# EAGLE design ross_comp (EAGLE 7.6.0)
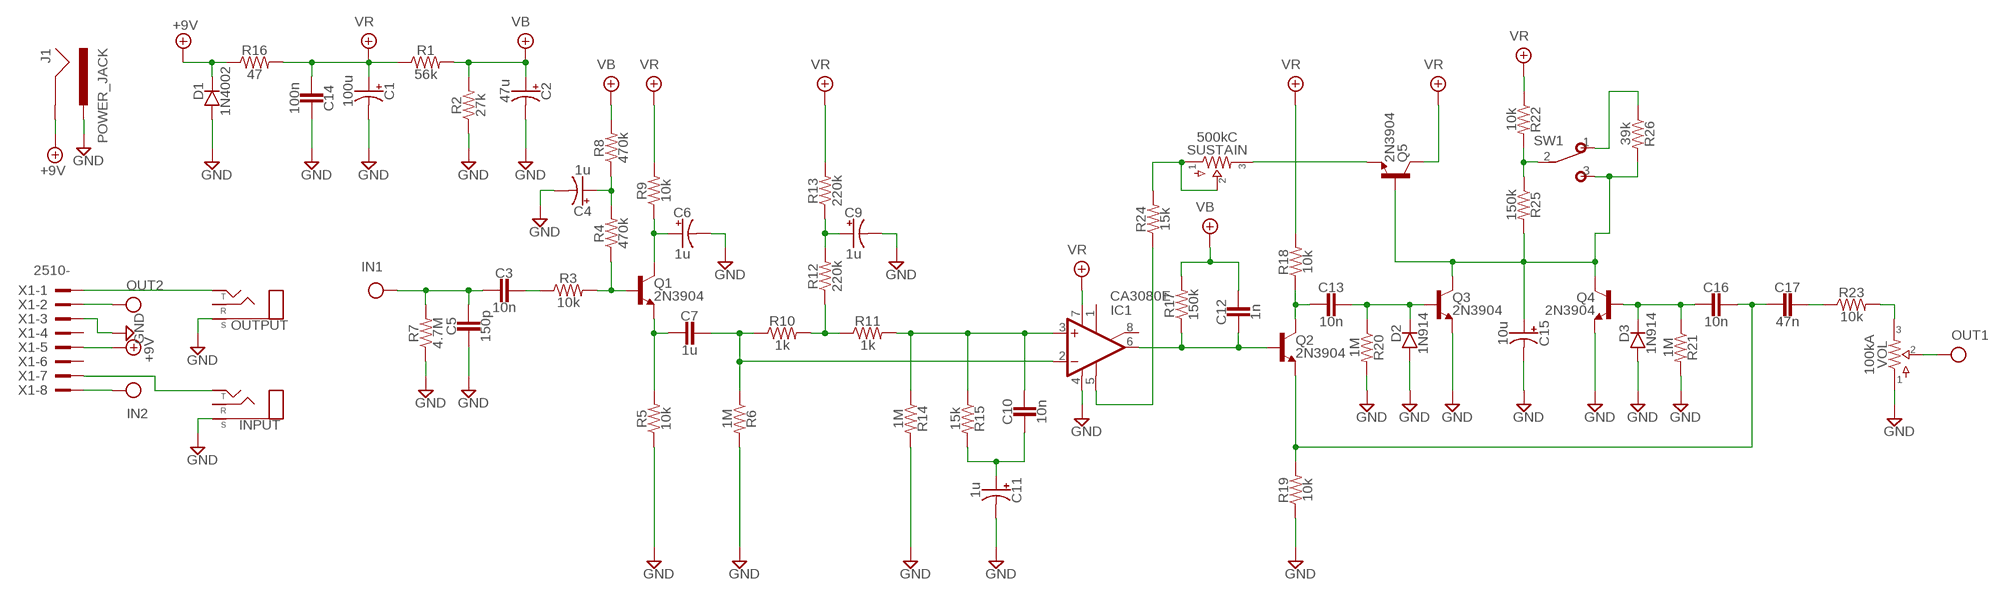
[diagram p0: schematic, sheet 1]

## Parts
C1  100u  0400  [040_020]
C2  47u  0400  [040_020]
C3  10n  CER/FILMBOX.1  [BOX_SMALL]
C4  1u  0400  [040_020]
C5  150p  CER/FILM2  [050X030_025_2]
C6  1u  0400  [040_020]
C7  1u  CER/FILMBOX.3  [BOX_BIG]
C9  1u  0400  [040_020]
C10  10n  CER/FILMBOX.1  [BOX_SMALL]
C11  1u  0400  [040_020]
C12  1n  CER/FILMBOX.1  [BOX_SMALL]
C13  10n  CER/FILMBOX.1  [BOX_SMALL]
C14  100n  CER/FILMBOX.1  [BOX_SMALL]
C15  10u  0400  [040_020]
C16  10n  CER/FILMBOX.1  [BOX_SMALL]
C17  47n  CER/FILMBOX.1  [BOX_SMALL]
D1  1N4002  DO41.2  [DO41-2]
D2  1N914  DO35.2  [DO35-2]
D3  1N914  DO35.2  [DO35-2]
IC1  CA3080E  3080TH  [DIL08]
INPUT  STEREONMJ  [NMJ6HCD2]
J1  POWER_JACK  [POWER_JACK_PTH]
OUTPUT  STEREONMJ  [NMJ6HCD2]
Q1  2N3904  [TO92-]
Q2  2N3904  [TO92-]
Q3  2N3904  [TO92-]
Q4  2N3904  [TO92-]
Q5  2N3904  [TO92-]
R1  56k  R_.3B  [R0207/3]
R2  27k  R_.3B  [R0207/3]
R3  10k  R_.3B  [R0207/3]
R4  470k  R_.3B  [R0207/3]
R5  10k  R_.3B  [R0207/3]
R6  1M  R_.3B  [R0207/3]
R7  4.7M  R_.3B  [R0207/3]
R8  470k  R_.3B  [R0207/3]
R9  10k  R_.3B  [R0207/3]
R10  1k  R_.3B  [R0207/3]
R11  1k  R_.3B  [R0207/3]
R12  220k  R_.3B  [R0207/3]
R13  220k  R_.3B  [R0207/3]
R14  1M  R_.3B  [R0207/3]
R15  15k  R_.3B  [R0207/3]
R16  47  R_.3B  [R0207/3]
R17  150k  R_.3B  [R0207/3]
R18  10k  R_.3B  [R0207/3]
R19  10k  R_.3B  [R0207/3]
R20  1M  R_.3B  [R0207/3]
R21  1M  R_.3B  [R0207/3]
R22  10k  R_.3B  [R0207/3]
R23  10k  R_.3B  [R0207/3]
R24  15k  R_.3B  [R0207/3]
R25  150k  R_.3B  [R0207/3]
R26  39k  R_.3B  [R0207/3]
SUSTAIN  500kC  POTS16MM  [16MM]
SW1  SPDT  [M9040P]
VOL  100kA  POTS16MM  [16MM]
X1  2510-  [PAK100/2500-10]

## Nets
+9V: D1.C J1.GND R16.1 X1.5
GND: C1.- C2.- C4.- C5.2 C6.- C9.- C11.- C14.1 C15.- D1.A D2.A D3.A IC1.4(V-) INPUT.S J1.PWR OUTPUT.S Q3.3(E) Q4.3(E) R2.1 R5.1 R6.2 R7.1 R14.2 R19.1 R20.2 R21.2 VOL.1 X1.3
IN: C3.2 C5.1 R7.2 X1.8
N$1: INPUT.T X1.7
N$2: C3.1 R3.1
N$3: Q1.2(B) R3.2 R4.1
N$4: OUTPUT.T X1.1
N$5: C4.+ R4.2 R8.1
N$6: R26.1 SW1.1(O)
N$7: C6.+ Q1.1(C) R9.1
N$8: C7.1 IC1.2(-IN) R6.1 R10.1
N$9: C7.2 Q1.3(E) R5.2
N$10: C10.1 IC1.3(+IN) R11.2 R14.1 R15.1
N$11: R10.2 R11.1 R12.1
N$12: C9.+ R12.2 R13.1
N$13: C10.2 C11.+ R15.2
N$14: C13.2 Q2.1(C) R18.1
N$15: C12.2 IC1.6(OUT) Q2.2(B) R17.1
N$16: C16.1 C17.2 Q2.3(E) R19.2
N$17: C13.1 D2.C Q3.2(B) R20.1
N$18: C15.+ Q3.1(C) Q4.1(C) Q5.2(B) R25.2 R26.2 SW1.3(S)
N$19: C16.2 D3.C Q4.2(B) R21.1
N$20: R22.2 R25.1 SW1.2(P)
N$21: C17.1 R23.1
N$22: R23.2 VOL.3
N$23: Q5.3(E) SUSTAIN.3
N$25: R24.2 SUSTAIN.1 SUSTAIN.2
N$26: IC1.5(OPT) R24.1
OUT: VOL.2 X1.2
VB: C2.+ C12.1 R1.2 R2.2 R8.2 R17.2
VR: C1.+ C14.2 IC1.7(V+) Q5.1(C) R1.1 R9.2 R13.2 R16.2 R18.2 R22.1
Unconnected: IC1.1(ON1) IC1.8(ON2) INPUT.R OUTPUT.R X1.4 X1.6

## Library data of the parts
C1 C2 C4 C6 C9 C11 C15 = pedals-capacitors-elec:040
C3 C5 C7 C10 C12-C14 C16 C17 = pedals-capacitors-film:CER/FILM: 47 - 120pF Xicon Ceramic Disc 2.5mm lead spacing
D1 = pedals-diodes:DO41: DO-41 Package Diodes: 1N4001 - 1N40019 Zener Diodes: 1N4728 - 1N4764
D2 D3 = pedals-diodes:DO35: DO-35 Package Diodes: 1N914
IC1 = pedals-integrated circuits:3080: OP AMP
INPUT OUTPUT = pedals-jacks:STEREO
J1 = pedals-jacks:POWER_JACK: Power Jack Connector This is the standard 5.5mm barrel jack for power. The PTH is the most common, proven, reliable, footprint. The Slot footprint only works if the mill layer is transmitted to the PCB fab house so be warned. Here are the connectors we sell at SparkFun: DC Barrel Power Jack/Connector <https://www.sparkfun.com/products/119> (PRT-00119) DC Barrel Power Jack/Connector (SMD) <https://www.sparkfun.com/products/12748> (PRT-12748) DC Barrel Jack Adapter - Breadboard Compatible <https://www.sparkfun.com/products/10811> (PRT-10811) It is used on this SparkFun product (and many, many others): SparkFun RedBoard - Programmed with Arduino <https://www.sparkfun.com/products/12757> (DEV-12757) Also, if you need a mating power supply or connector, please check these out: Wall Adapter Power Supply - 9VDC 650mA <https://www.sparkfun.com/products/298> (TOL-00298) DC Barrel Jack Adapter - Male <https://www.sparkfun.com/products/10287> (PRT-10287); PROD_ID: CONN-08197
Q1-Q5 = pedals-transistors:2N3904: NPN Transistor
R1-R26 = pedals-resistors:R_
SUSTAIN VOL = pedals-potentiometers:POTS
SW1 = pedals-switches:SPDT: TOGGLE SWITCH Marquardt
X1 = pedals-headers:2510-: 3M (TM) Pak 100 4-Wall Header Source: 3M; MF: 3M; MPN: 2510-6002UB; OC_FARNELL: 9838244; OC_NEWARK: 46F4725

## Board
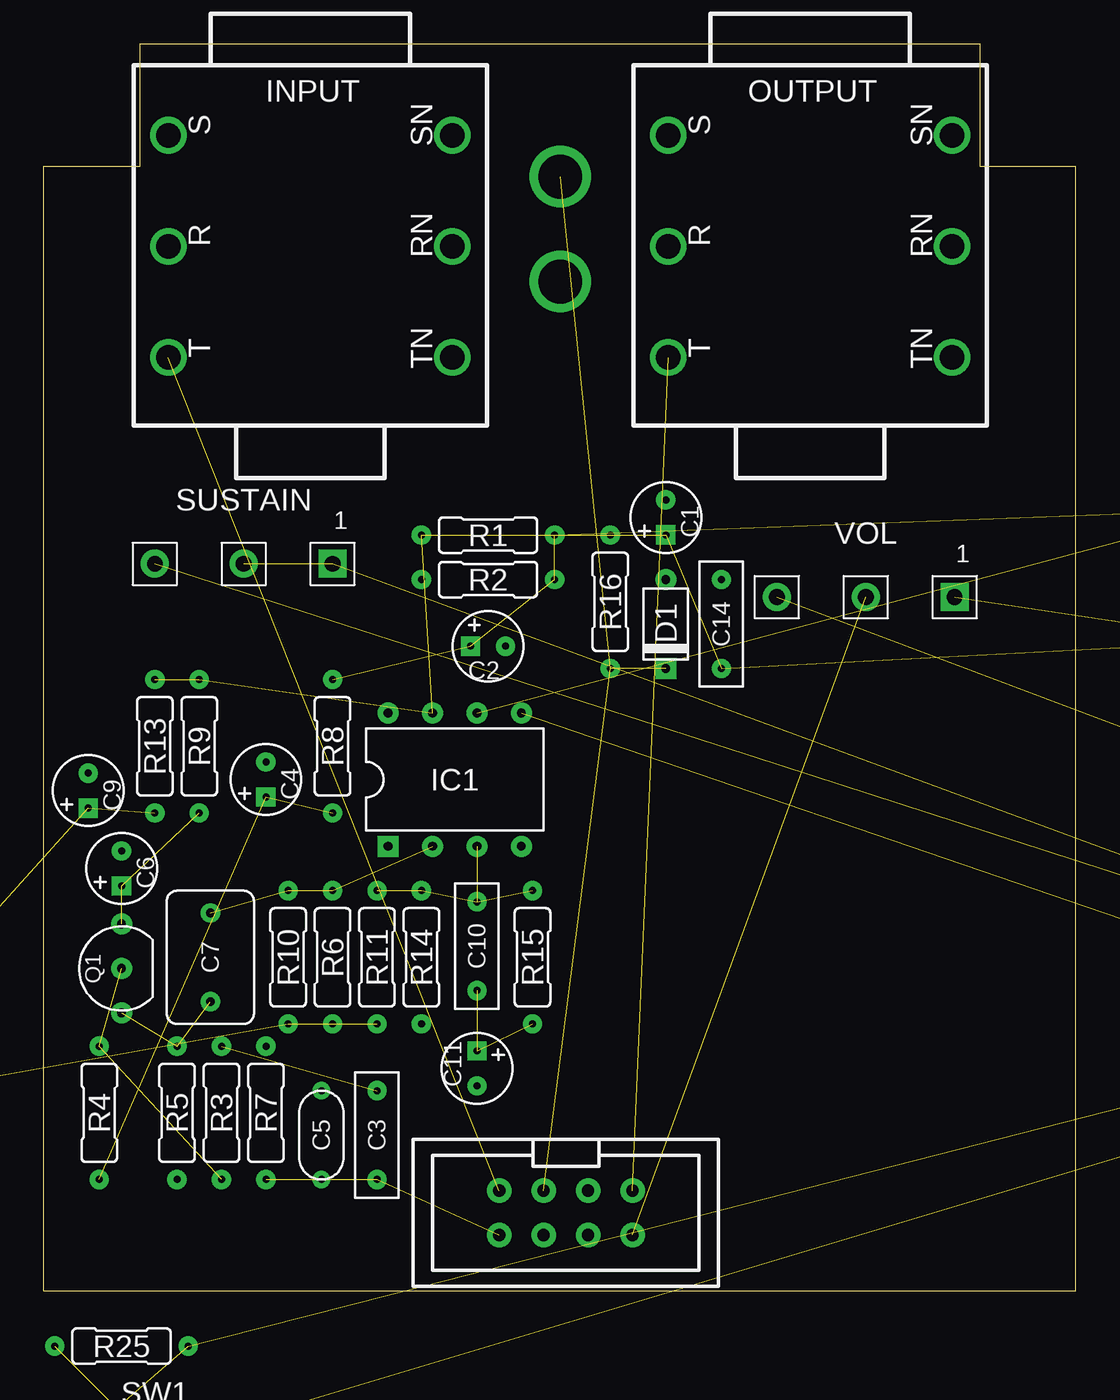
[diagram p1: board, top side]
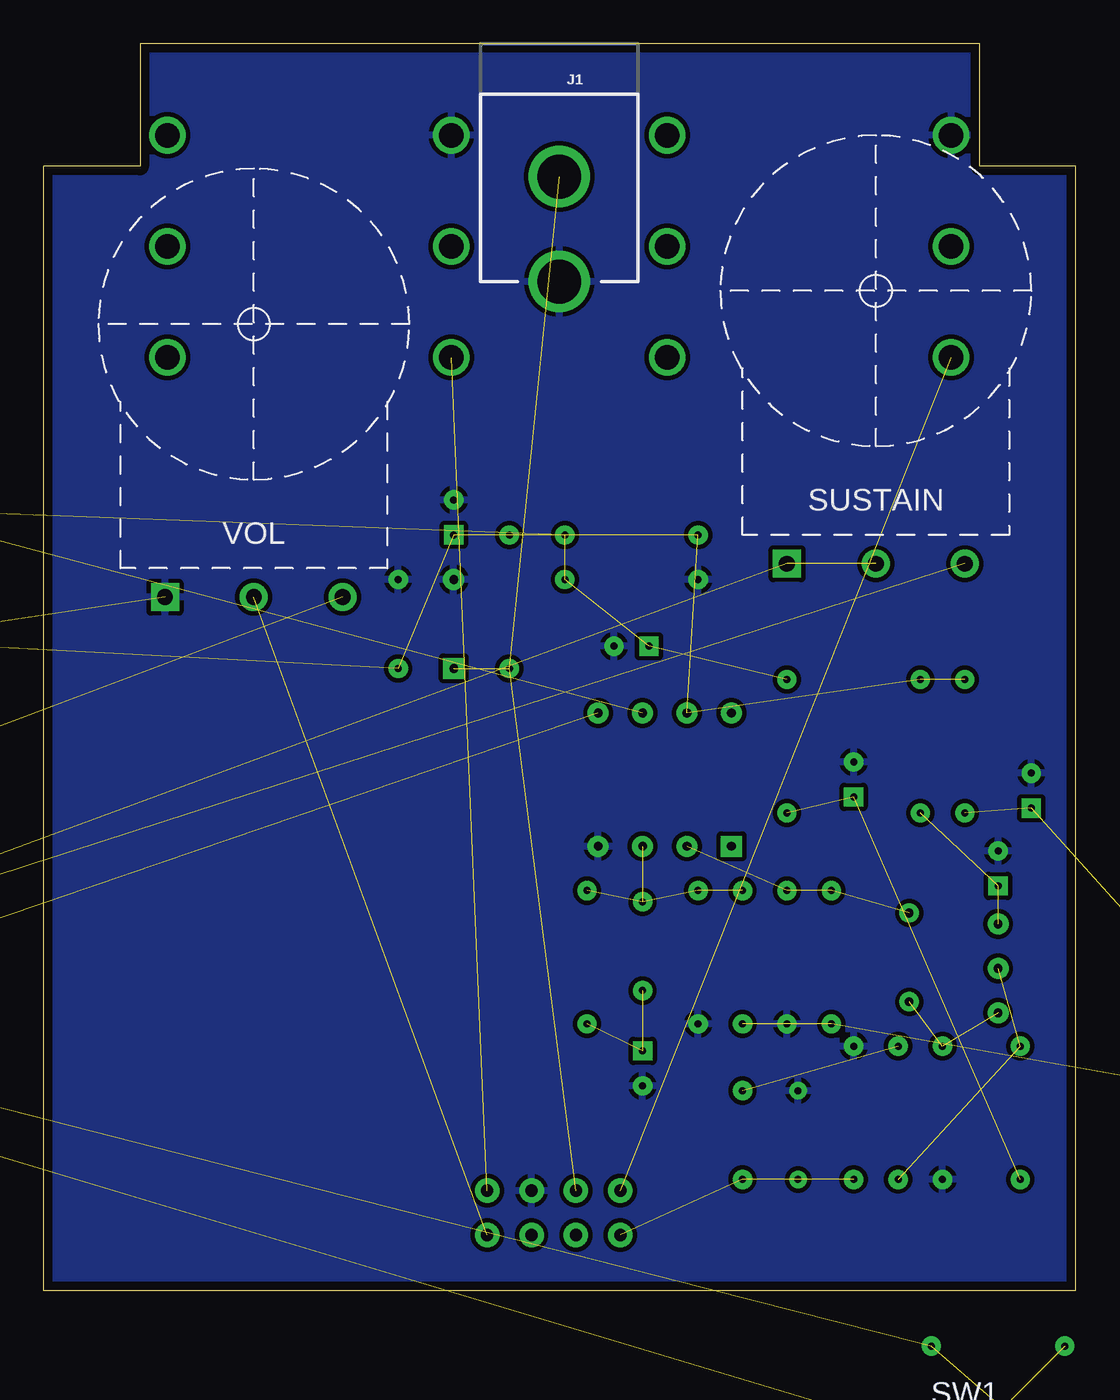
[diagram p2: board, bottom side, seen from below]

Size 59 x 71.27 mm. Coordinates in mm from the lower left corner, seen from the top.
Copper layers (1*16): Top 0.035mm / dielectric 1.6mm / Bottom 0.035mm
Design rules "Elecrow_2-layer_PCB_eagle_rule": minimum track width 6mil, minimum drill 12mil, track to track 6mil, track to pad 6mil, pad to pad 6mil, via to via 8mil, smd to smd 0mil, copper to edge 20mil, drill to drill 10mil, minimum pad ring 6mil, minimum via ring 6mil, stop-mask expansion 0mil, vias tented up to drill 100mil, thermal gap 10mil

### Footprints (pad centres in the part's own frame; a part is rotated, then mirrored left to right if it is on the bottom)
040_020 = drill 0.4 pad 1.1 square: + -1.001,0 | drill 0.4 pad 1.1: - 1.001,0
BOX_SMALL = drill 0.4 pad 1.1: 1 -2.54,0; 2 2.54,0
050X030_025_2 = drill 0.4 pad 1: 1 -2.54,0; 2 2.54,0
BOX_BIG = drill 0.5 pad 1.1: 1 -2.54,0; 2 2.54,0
DO41-2 = drill 0.5 pad 1.2: A 2.54,0 | drill 0.5 pad 1.2 square: C -2.54,0
DO35-2 = drill 0.5 pad 1.2: A 2.54,0 | drill 0.5 pad 1.2 square: C -2.54,0
DIL08 = drill 0.5 pad 1.2 square: 1 -3.81,-3.81 | drill 0.5 pad 1.2: 2 -1.27,-3.81; 3 1.27,-3.81; 4 3.81,-3.81; 5 3.81,3.81; 6 1.27,3.81; 7 -1.27,3.81; 8 -3.81,3.81
NMJ6HCD2 = drill 1.4: R 0,8.115; RN 0,-8.115; S 6.35,8.115; SN 6.35,-8.115; T -6.35,8.115; TN -6.35,-8.115
POWER_JACK_PTH = drill 2.5: GND 0,7.7; PWR 0,13.7
TO92- = drill 0.5 pad 1.2: 1 2.54,0; 2 0,0; 3 -2.54,0
R0207/3 = drill 0.4 pad 1.1: 1 -3.81,0; 2 3.81,0
16MM = drill 0.9 pad 1.6 square: 1 5.08,-1 | drill 0.9 pad 1.6: 2 0,-1; 3 -5.08,-1
M9040P = drill 2.4 square: 1 4.699,0 | drill 2.4: 2 0,0; 3 -4.699,0
PAK100/2500-10 = drill 0.7 pad 1.4: 1 -3.81,-1.27; 2 -3.81,1.27; 3 -1.27,-1.27; 4 -1.27,1.27; 5 1.27,-1.27; 6 1.27,1.27; 7 3.81,-1.27; 8 3.81,1.27

### Placement (x,y rotation side)
C1  35.56,44.2 90 top
C2  25.4,36.83 0 top
C3  19.05,8.89 270 top
C4  12.7,29.21 90 top
C5  15.88,8.89 90 top
C6  4.45,24.13 90 top
C7  9.53,19.05 270 top
C9  2.54,28.57 90 top
C10  24.77,19.68 270 top
C11  24.77,12.7 270 top
C12  81.92,45.09 0 top  (outside the outline)
C13  81.92,33.02 0 top  (outside the outline)
C14  38.73,38.1 270 top
C15  81.28,15.24 0 top  (outside the outline)
C16  81.92,6.35 0 top  (outside the outline)
C17  96.52,22.23 0 top  (outside the outline)
D1  35.56,38.1 90 top
D2  81.92,27.94 0 top  (outside the outline)
D3  81.92,11.43 0 top  (outside the outline)
IC1  23.5,29.21 0 top
INPUT  15.24,59.69 90 top
J1  29.53,71.37 180 bottom
OUTPUT  43.81,59.69 90 top
Q1  4.45,18.41 90 top
Q2  81.92,41.27 0 top  (outside the outline)
Q3  81.92,24.13 0 top  (outside the outline)
Q4  81.92,19.68 0 top  (outside the outline)
Q5  96.52,13.34 0 top  (outside the outline)
R1  25.4,43.18 0 top
R2  25.4,40.64 0 top
R3  10.16,10.16 270 top
R4  3.17,10.16 270 top
R5  7.62,10.16 90 top
R6  16.51,19.05 270 top
R7  12.7,10.16 270 top
R8  16.51,31.11 90 top
R9  8.89,31.11 90 top
R10  13.97,19.05 270 top
R11  19.05,19.05 90 top
R12  -7.62,12.06 180 top  (outside the outline)
R13  6.35,31.11 90 top
R14  21.59,19.05 270 top
R15  27.94,19.05 270 top
R16  32.38,39.37 90 top
R17  83.19,47.62 0 top  (outside the outline)
R18  83.19,38.1 0 top  (outside the outline)
R19  83.19,35.56 0 top  (outside the outline)
R20  83.19,30.48 0 top  (outside the outline)
R21  83.19,8.89 0 top  (outside the outline)
R22  97.79,19.68 0 top  (outside the outline)
R23  97.79,17.14 0 top  (outside the outline)
R24  97.79,10.16 0 top  (outside the outline)
R25  4.45,-3.17 0 top  (outside the outline)
R26  4.45,-12.7 0 top  (outside the outline)
SUSTAIN  11.43,42.55 0 top
SW1  6.35,-8.89 0 top  (outside the outline)
U$1  [125B_PCB]  0,1.27 0 top
VOL  46.99,40.64 0 top
X1  29.84,4.45 180 top

### Tracks (layer width: path | path; a pad name or v marks a point on that pad's centre or on a via)
+9V  (3 unrouted)
GND  (8 unrouted)
  pour Bottom (isolate 0.254): 0,71.12 0,0 59.05,0 59.05,72.39 0,72.39
IN  (3 unrouted)
N$1  (1 unrouted)
N$2  (1 unrouted)
N$3  (2 unrouted)
N$4  (1 unrouted)
N$5  (2 unrouted)
N$6  (1 unrouted)
N$7  (2 unrouted)
N$8  (3 unrouted)
N$9  (2 unrouted)
N$10  (4 unrouted)
N$11  (2 unrouted)
N$12  (2 unrouted)
N$13  (2 unrouted)
N$14  (2 unrouted)
N$15  (3 unrouted)
N$16  (3 unrouted)
N$17  (3 unrouted)
N$18  (6 unrouted)
N$19  (3 unrouted)
N$20  (2 unrouted)
N$21  (1 unrouted)
N$22  (1 unrouted)
N$23  (1 unrouted)
N$25  (2 unrouted)
N$26  (1 unrouted)
OUT  (1 unrouted)
VB  (5 unrouted)
VR  (9 unrouted)